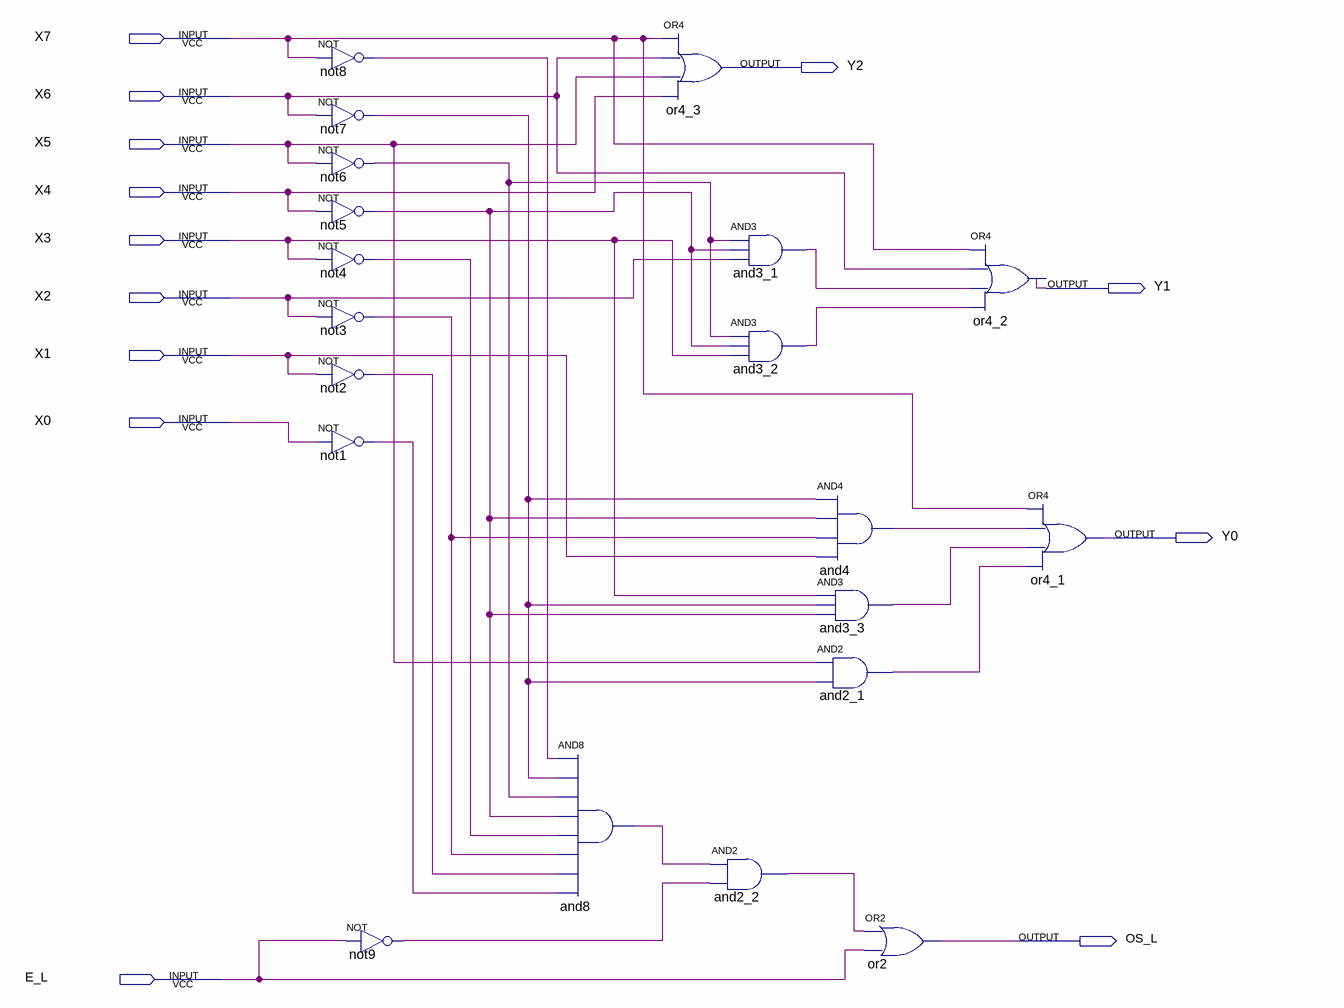
[diagram p0: schematic sheet]
// Quartus schematic PEnc8_3.bdf as structural Verilog: 20 symbols, 13 pins
module PEnc8_3 (
  input  X7,
  input  X6,
  input  X5,
  input  X4,
  input  X3,
  input  X2,
  input  X1,
  input  X0,
  input  E_L,
  output Y2,
  output Y1,
  output Y0,
  output OS_L
);

  wire and2_1_out, and2_2_out, and3_1_out, and3_2_out, and3_3_out, and4_out, and8_out, not1_out, not2_out,
       not3_out, not4_out, not5_out, not6_out, not7_out, not8_out, not9_out;

  not not8 (not8_out, X7);
  not not7 (not7_out, X6);
  not not6 (not6_out, X5);
  not not5 (not5_out, X4);
  not not4 (not4_out, X3);
  not not3 (not3_out, X2);
  not not2 (not2_out, X1);
  not not1 (not1_out, X0);
  not not9 (not9_out, E_L);
  and and8 (and8_out, not8_out, not7_out, not6_out, not5_out, not4_out, not3_out, not2_out, not1_out);
  or or4_3 (Y2, X7, X6, X5, X4);
  and and3_1 (and3_1_out, not6_out, not5_out, X2);
  and and3_2 (and3_2_out, not6_out, not5_out, X3);
  and and2_2 (and2_2_out, and8_out, not9_out);
  and and4 (and4_out, not7_out, not5_out, not3_out, X1);
  and and3_3 (and3_3_out, X3, not7_out, not5_out);
  and and2_1 (and2_1_out, X5, not7_out);
  or or2 (OS_L, and2_2_out, E_L);
  or or4_2 (Y1, X7, X6, and3_1_out, and3_2_out);
  or or4_1 (Y0, X7, and4_out, and3_3_out, and2_1_out);
endmodule
